# Altium schematic sheet LVDS.SchDoc: Ixora
size A3; Organization: Toradex AG; Address1: Altsagenstrasse 5; Address2: Horw; Address3: 6048; Address4: Switzerland; DocumentNumber: 14; Revision: V1.1; SheetNumber: 14; SheetTotal: 19; PageSetup: Record=PageOptions|CenterHorizontal=True|CenterVertical=True|PrintScale=0.73|XCorrection=1.00|YCorrection=1.00|PrintKind=0|BorderSize=5000000|LeftOffset=0|BottomOffset=0|Orientation=2|PaperLength=1000|PaperWidth=1000|Scale=100|PaperSource=7|PrintQuality=-4|MediaType=1|DitherType=10|PaperKind=A4|PrintScaleMode=1
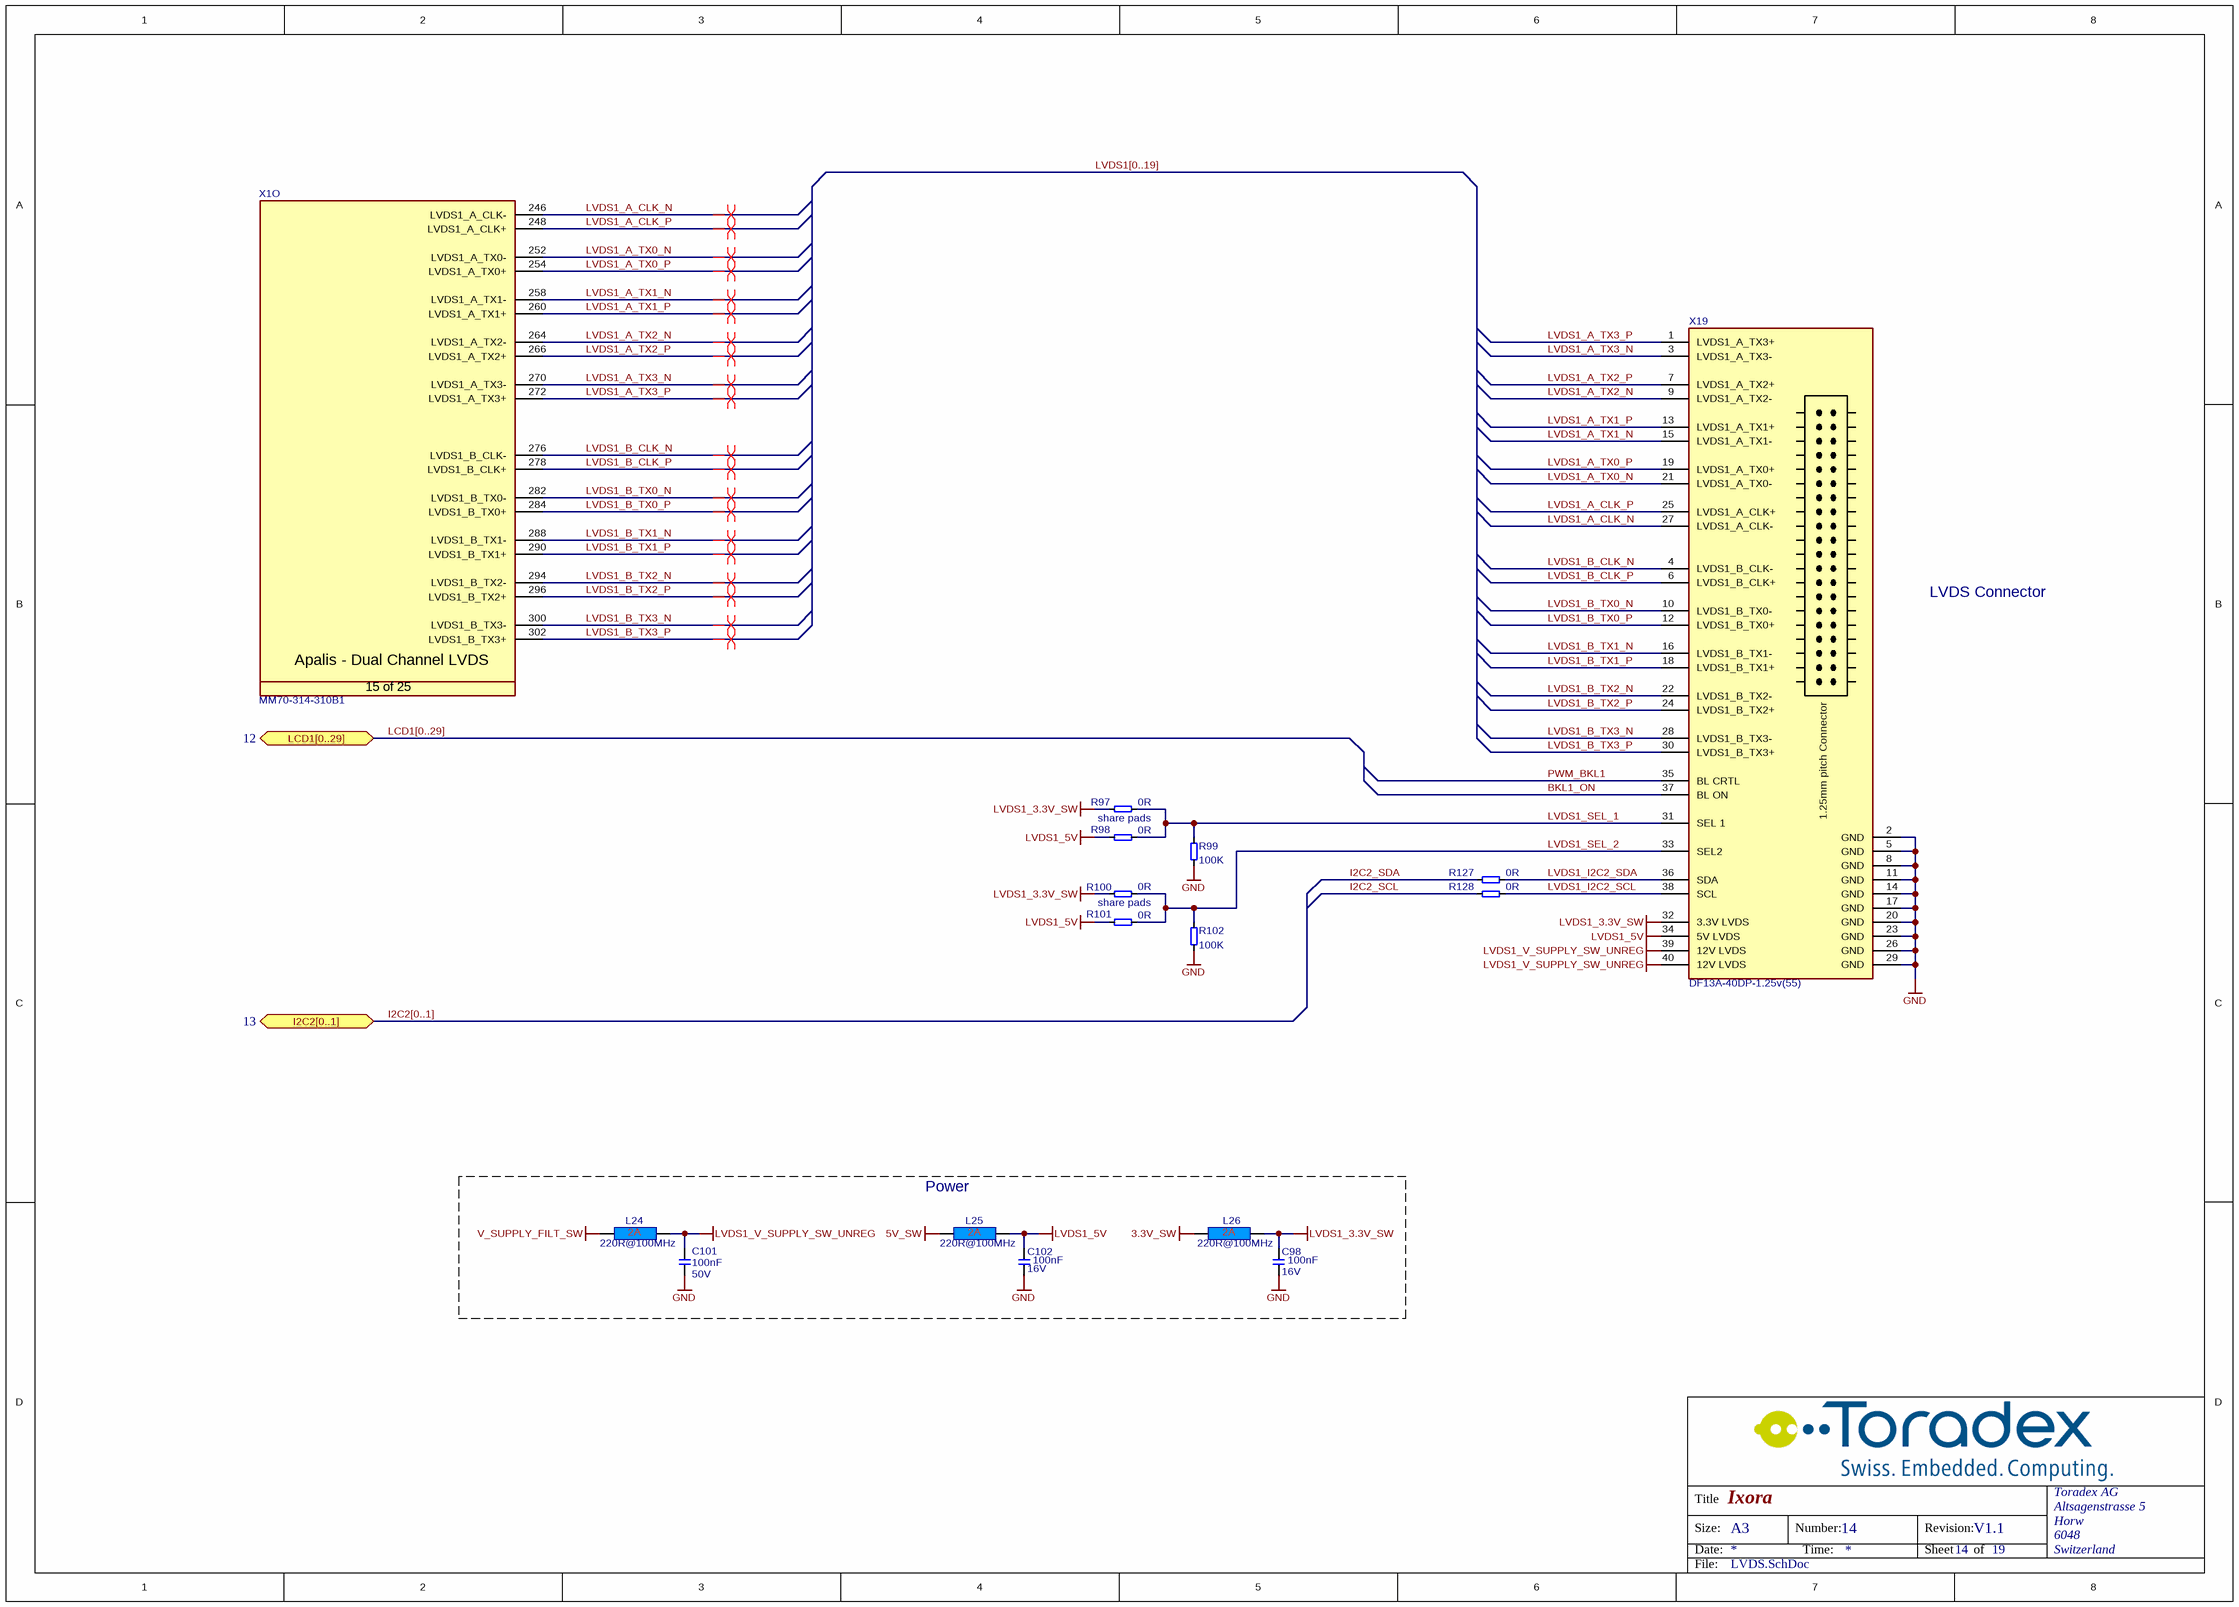
[diagram p0: LVDS.SchDoc]

## Parts
C98  Rating: 16V  [CAPC1005X60N]  (hidden comment: 100nF)
C101  Rating: 50V  [CAPC1005X60N]  (hidden comment: 100nF)
C102  Rating: 16V  [CAPC1005X60N]  (hidden comment: 100nF)
L24  220R@100MHz  [INDC1608X95N]
L25  220R@100MHz  [INDC1608X95N]
L26  220R@100MHz  [INDC1608X95N]
R97  0R  [T_RESC0603X30N]
R98  0R  [T_RESC0603X30N]
R99  100K  [RESC1005X40N]
R100  0R  [T_RESC0603X30N]
R101  0R  [T_RESC0603X30N]
R102  100K  [RESC1005X40N]
R127  0R  [T_RESC0603X30N]
R128  0R  [T_RESC0603X30N]
X1  Manufacturer Part No.: MM70-314-310B1  [T_JAE_MM70-314-310B1]  (hidden comment: CON-JAE-MM70-314-310B1-314-0.5mm)  (part O of 25)
X19  Manufacturer Part No.: DF13A-40DP-1.25v(55)  [T_HIROSE_DF13A-40DP-1.25V(55)]  (hidden comment: CON-Hirose-DF13A-40DP-1.25v(55)-2x10-1mm)

## Blocks framed on the sheet
Power: C98 C101 C102 L24-L26

## Ports
I2C2[0..1] (bidir, see 13), LCD1[0..29] (bidir, see 12)

## Nets
3.3V_SW: L26.1
5V_SW: L25.1
GND: C98.1 C101.1 C102.1 R99.1 R102.1 X19.2(GND) X19.5(GND) X19.8(GND) X19.11(GND) X19.14(GND) X19.17(GND) X19.20(GND) X19.23(GND) X19.26(GND) X19.29(GND)
LVDS1_3.3V_SW: C98.2 L26.2 R97.1 R100.1 X19.32(3.3V_LVDS)
LVDS1_5V: C102.2 L25.2 R98.1 R101.1 X19.34(5V_LVDS)
LVDS1_V_SUPPLY_SW_UNREG: C101.2 L24.2 X19.39(12V_LVDS) X19.40(12V_LVDS)
V_SUPPLY_FILT_SW: L24.1
BKL1_ON: X19.37(BL_ON)
I2C2_SCL: R128.1
I2C2_SDA: R127.1
LVDS1_A_CLK_N: X1.246(LVDS1_A_CLK-) X19.27(LVDS1_A_CLK-)
LVDS1_A_CLK_P: X1.248(LVDS1_A_CLK+) X19.25(LVDS1_A_CLK+)
LVDS1_A_TX0_N: X1.252(LVDS1_A_TX0-) X19.21(LVDS1_A_TX0-)
LVDS1_A_TX0_P: X1.254(LVDS1_A_TX0+) X19.19(LVDS1_A_TX0+)
LVDS1_A_TX1_N: X1.258(LVDS1_A_TX1-) X19.15(LVDS1_A_TX1-)
LVDS1_A_TX1_P: X1.260(LVDS1_A_TX1+) X19.13(LVDS1_A_TX1+)
LVDS1_A_TX2_N: X1.264(LVDS1_A_TX2-) X19.9(LVDS1_A_TX2-)
LVDS1_A_TX2_P: X1.266(LVDS1_A_TX2+) X19.7(LVDS1_A_TX2+)
LVDS1_A_TX3_N: X1.270(LVDS1_A_TX3-) X19.3(LVDS1_A_TX3-)
LVDS1_A_TX3_P: X1.272(LVDS1_A_TX3+) X19.1(LVDS1_A_TX3+)
LVDS1_B_CLK_N: X1.276(LVDS1_B_CLK-) X19.4(LVDS1_B_CLK-)
LVDS1_B_CLK_P: X1.278(LVDS1_B_CLK+) X19.6(LVDS1_B_CLK+)
LVDS1_B_TX0_N: X1.282(LVDS1_B_TX0-) X19.10(LVDS1_B_TX0-)
LVDS1_B_TX0_P: X1.284(LVDS1_B_TX0+) X19.12(LVDS1_B_TX0+)
LVDS1_B_TX1_N: X1.288(LVDS1_B_TX1-) X19.16(LVDS1_B_TX1-)
LVDS1_B_TX1_P: X1.290(LVDS1_B_TX1+) X19.18(LVDS1_B_TX1+)
LVDS1_B_TX2_N: X1.294(LVDS1_B_TX2-) X19.22(LVDS1_B_TX2-)
LVDS1_B_TX2_P: X1.296(LVDS1_B_TX2+) X19.24(LVDS1_B_TX2+)
LVDS1_B_TX3_N: X1.300(LVDS1_B_TX3-) X19.28(LVDS1_B_TX3-)
LVDS1_B_TX3_P: X1.302(LVDS1_B_TX3+) X19.30(LVDS1_B_TX3+)
LVDS1_I2C2_SCL: R128.2 X19.38(SCL)
LVDS1_I2C2_SDA: R127.2 X19.36(SDA)
LVDS1_SEL_1: R97.2 R98.2 R99.2 X19.31(SEL_1)
LVDS1_SEL_2: R100.2 R101.2 R102.2 X19.33(SEL2)
PWM_BKL1: X19.35(BL_CRTL)

## Buses and harness runs
bus I2C2[0..1] = port I2C2[0..1]
bus LCD1[0..29] = port LCD1[0..29]
bus LVDS1[0..19]

## Layout directives
differential pair: LVDS1_A_CLK_N, LVDS1_A_CLK_P, LVDS1_A_TX0_N, LVDS1_A_TX0_P, LVDS1_A_TX1_N, LVDS1_A_TX1_P, LVDS1_A_TX2_N, LVDS1_A_TX2_P, LVDS1_A_TX3_N, LVDS1_A_TX3_P, LVDS1_B_CLK_N, LVDS1_B_CLK_P, LVDS1_B_TX0_N, LVDS1_B_TX0_P, LVDS1_B_TX1_N, LVDS1_B_TX1_P, LVDS1_B_TX2_N, LVDS1_B_TX2_P, LVDS1_B_TX3_N, LVDS1_B_TX3_P

## Notes on the sheet
- (near X19) LVDS Connector
- (near R97) share pads
- (near R100) share pads
- Title
- Size:
- Date:
- A3
- Number:
- Time:
- Revision:
- Sheet
- of
- File:
- (in symbol CON-Hirose-DF13A-40DP-1.25v(55)-2x20-1.25mm) 1.25mm pitch Connector
- (in symbol CON-JAE-MM70-314-310B1-314-0.5mm, part O) Apalis - Dual Channel LVDS; 15 of 25

## Library data of the parts
C98 C102 = C-X7R-100nF-16V-10%-0402: Capacitor Ceramic X7R 100nF 16V 10% 0402; Tolerance: 10%; Type: X7R; Value: 100nF
C101 = C-X7R-100nF-50V-10%-0402: Capacitor Ceramic X7R 100nF 50V 10% 0402; Tolerance: 10%; Type: X7R; Value: 100nF
L24-L26 = L-220R@100MHz-2A-25%-0603: 220R@100MHz 2A EMI FILTER; Tolerance: 25%; Rating: 2A; Value: 220R@100MHz
R97 R98 R100 R101 R127 R128 = R-0R-63mW-1%-0603: Resistor 0 ohm 63mW 1% 0603; Rating: 63mW; Tolerance: 1%; Value: 0R
R99 R102 = R-100KR-63mW-5%-0402: Resistor 100 Kohm 63mW 5% 0402; Value: 100KR; Rating: 63mW; Tolerance: 5%
X1 = CON-JAE-MM70-314-310B1-314-0.5mm: MXM3 Connector; Manufacturer Name: JAE; No. of ways: 314
X19 = CON-Hirose-DF13A-40DP-1.25v(55)-2x20-1.25mm: LVDS Connector; Manufacturer Name: Hirose; No. of ways: 2x20; Pitch: 1.25mm